# Altium schematic sheet FAT42.SchDoc
size A3
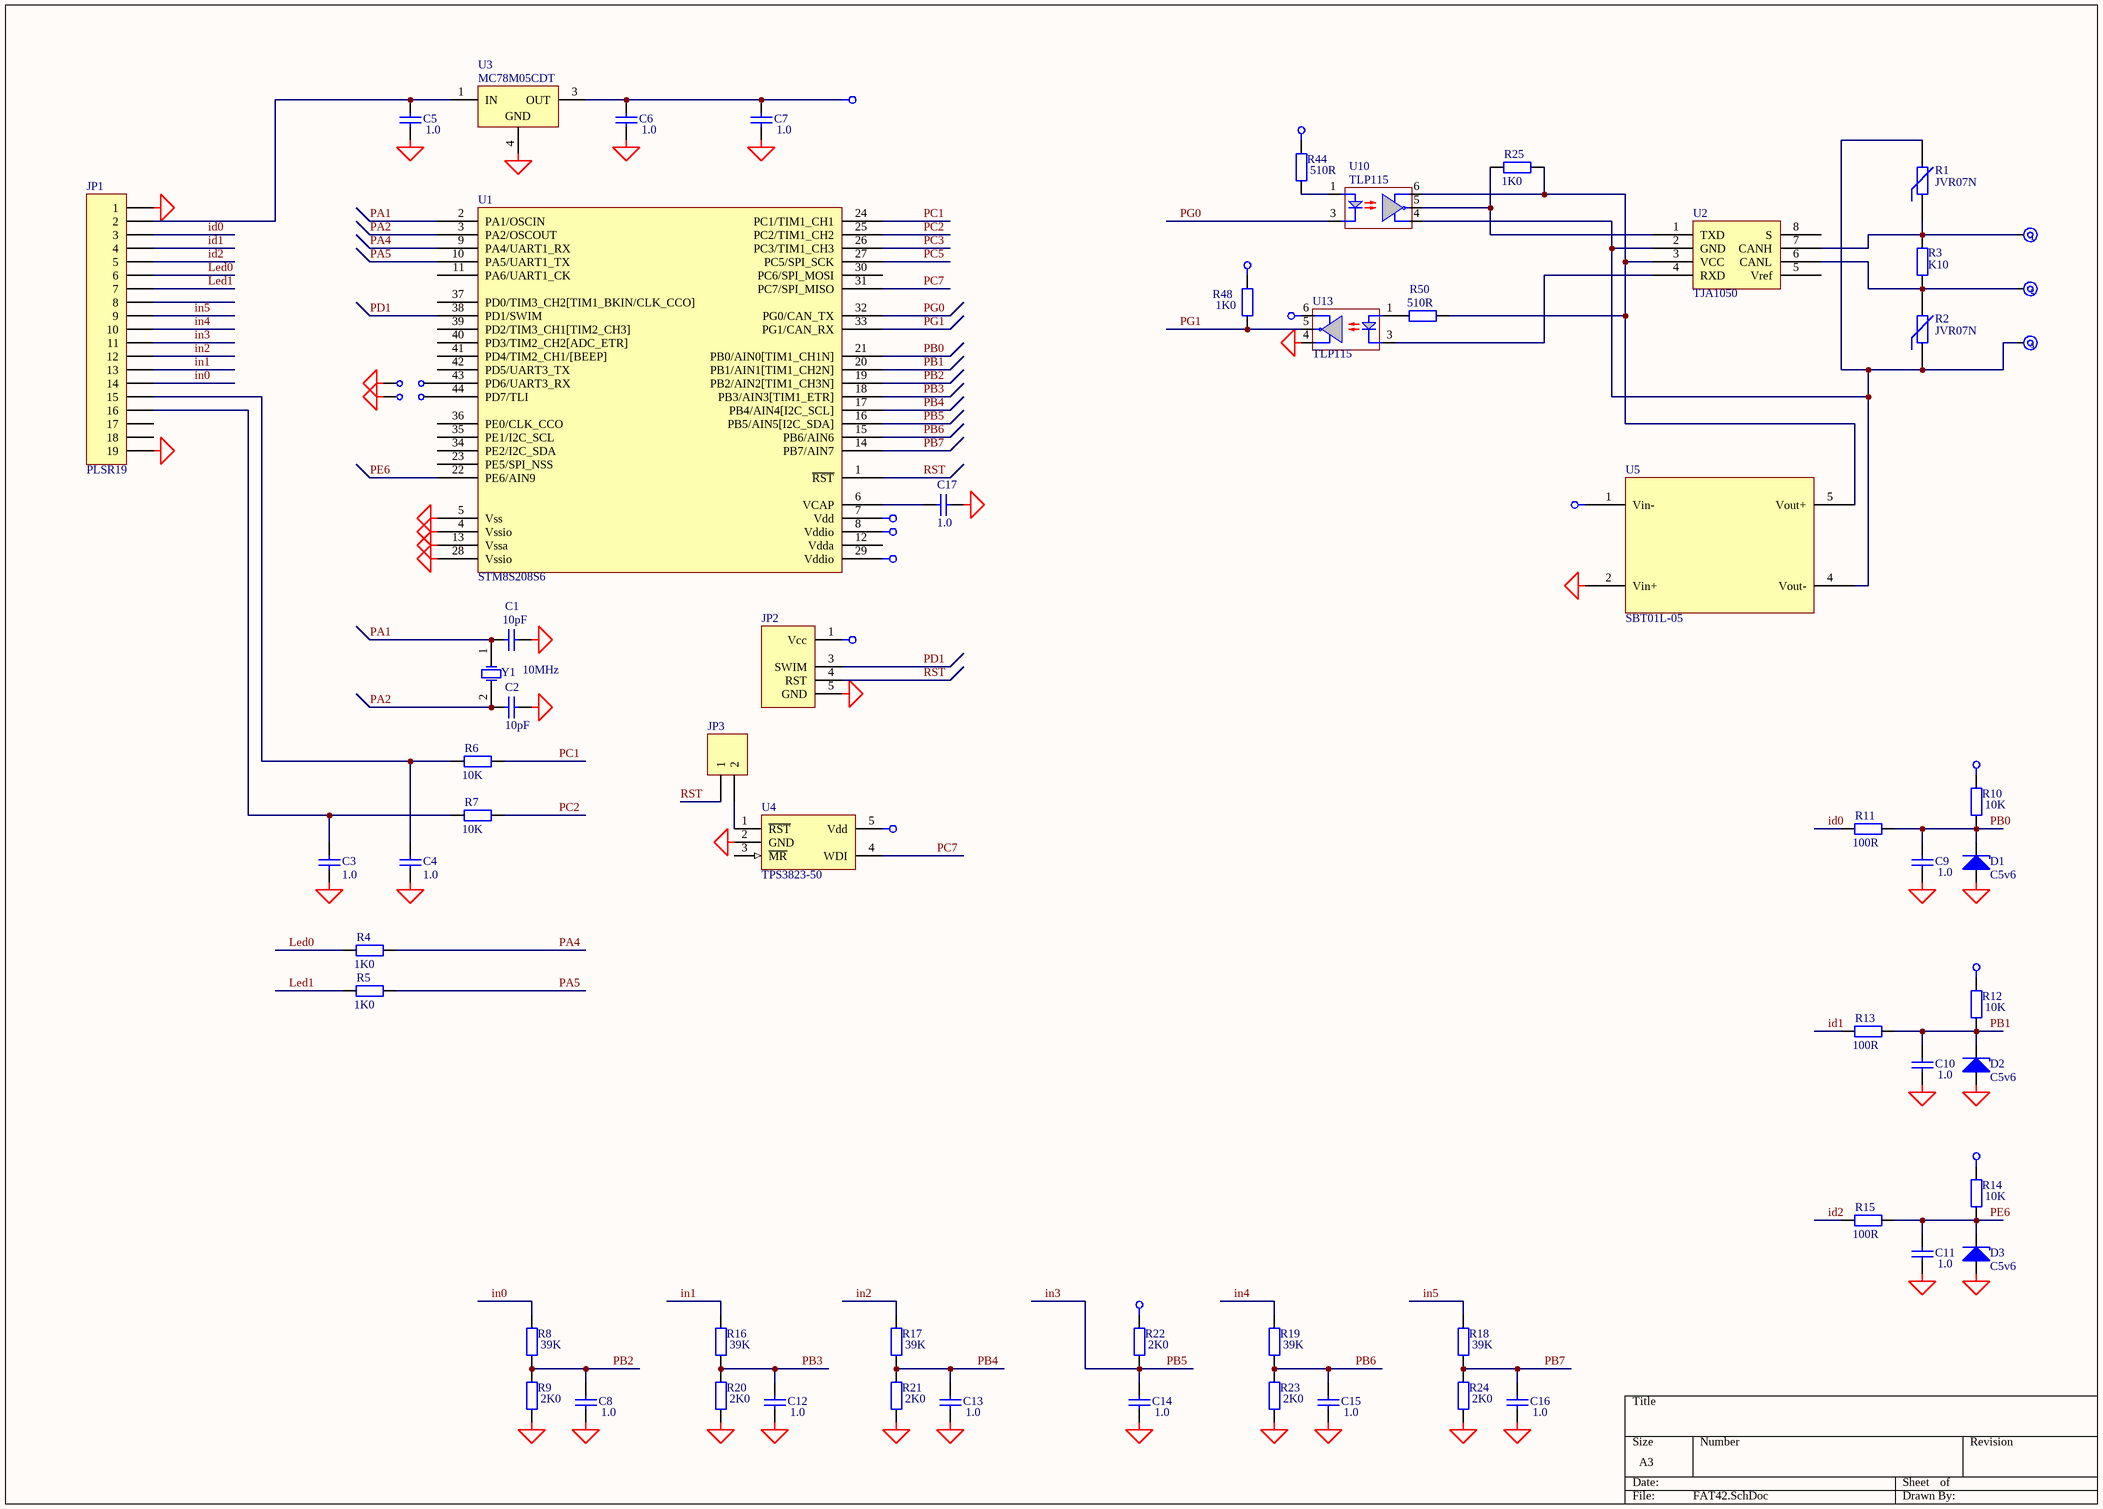
[diagram p0: FAT42.SchDoc]

## Parts
1  (no value)  [PIN2R]
2  (no value)  [PIN2R]
3  (no value)  [PIN2R]
C1  10pF  [_1206]
C2  10pF  [_1206]
C3  1.0  [_1206]
C4  1.0  [_1206]
C5  1.0  [_1206]
C6  1.0  [_1206]
C7  1.0  [_1206]
C8  1.0  [_1206]
C9  1.0  [_1206]
C10  1.0  [_1206]
C11  1.0  [_1206]
C12  1.0  [_1206]
C13  1.0  [_1206]
C14  1.0  [_1206]
C15  1.0  [_1206]
C16  1.0  [_1206]
C17  1.0  [_1206]
D1  C5v6  [_1206d]
D2  C5v6  [_1206d]
D3  C5v6  [_1206d]
J1  (no value)  [jmp]
J2  (no value)  [jmp]
JP1  PLSR19  [HDR1X19]
JP2  (no value)  [HDR1X5_uart]
JP3  PLS2  [HDR1X2]  (value not drawn)
R1  JVR07N  [JVR07N]
R2  JVR07N  [JVR07N]
R3  K10  [_1206]
R4  1K0  [_1206]
R5  1K0  [_1206]
R6  10K  [_1206]
R7  10K  [_1206]
R8  39K  [_1206]
R9  2K0  [_1206]
R10  10K  [_1206]
R11  100R  [_1206]
R12  10K  [_1206]
R13  100R  [_1206]
R14  10K  [_1206]
R15  100R  [_1206]
R16  39K  [_1206]
R17  39K  [_1206]
R18  39K  [_1206]
R19  39K  [_1206]
R20  2K0  [_1206]
R21  2K0  [_1206]
R22  2K0  [_1206]
R23  2K0  [_1206]
R24  2K0  [_1206]
R25  1K0  [_1206]
R44  510R  [_1206]
R48  1K0  [_1206]
R50  510R  [_1206]
U1  STM8S208S6  [QFP10X10-G44/G10N]
U2  TJA1050  [SO-G8/D5]
U3  MC78M05CDT  [SIP-G3/Z11.05]
U4  TPS3823-50  [SO-G5/P.95]
U5  SBT01L-05  [SBT01DET01]
U10  TLP115  [tlp115]
U13  TLP115  [tlp115]
Y1  10MHz  [QWARZ1]

## Nets
+5v: C6.2 C7.2 JP2.1(Vcc) R10.1 R12.1 R14.1 R22.2 R44.2 R48.2 U1.7(Vdd) U1.8(Vddio) U1.29(Vddio) U3.3(OUT) U4.5(Vdd) U5.1(Vin-) U13.6
GND: C1.1 C2.1 C3.1 C4.1 C5.1 C6.1 C7.1 C8.1 C9.1 C10.1 C11.1 C12.1 C13.1 C14.1 C15.1 C16.1 C17.1 D1.1(A) D2.1(A) D3.1(A) J1.1 J2.1 JP1.1 JP1.19 JP2.5(GND) R9.1 R20.1 R21.1 R23.1 R24.1 U1.4(Vssio) U1.5(Vss) U1.13(Vssa) U1.28(Vssio) U3.4(GND) U4.2(GND) U5.2(Vin+) U13.4
id0: JP1.3 R11.2
id1: JP1.4 R13.2
id2: JP1.5 R15.2
in0: JP1.14 R8.2
in1: JP1.13 R16.2
in2: JP1.12 R17.2
in3: C14.2 JP1.11 R22.1 U1.16(PB5/AIN5[I2C_SDA])  [also labelled PB5]
in4: JP1.10 R19.2
in5: JP1.9 R18.2
Led0: JP1.6 R4.1
Led1: JP1.7 R5.1
PA1: C1.2 U1.2(PA1/OSCIN) Y1.1(OSC1)
PA2: C2.2 U1.3(PA2/OSCOUT) Y1.2(OSC2)
PA4: R4.2 U1.9(PA4/UART1_RX)
PA5: R5.2 U1.10(PA5/UART1_TX)
PB0: C9.2 D1.2(K) R10.2 R11.1 U1.21(PB0/AIN0[TIM1_CH1N])
PB1: C10.2 D2.2(K) R12.2 R13.1 U1.20(PB1/AIN1[TIM1_CH2N])
PB2: C8.2 R8.1 R9.2 U1.19(PB2/AIN2[TIM1_CH3N])
PB3: C12.2 R16.1 R20.2 U1.18(PB3/AIN3[TIM1_ETR])
PB4: C13.2 R17.1 R21.2 U1.17(PB4/AIN4[I2C_SCL])
PB6: C15.2 R19.1 R23.2 U1.15(PB6/AIN6)
PB7: C16.2 R18.1 R24.2 U1.14(PB7/AIN7)
PC1: R6.1 U1.24(PC1/TIM1_CH1)
PC2: R7.1 U1.25(PC2/TIM1_CH2)
PC3: U1.26(PC3/TIM1_CH3)
PC5: U1.27(PC5/SPI_SCK)
PC7: U1.31(PC7/SPI_MISO) U4.4(WDI)
PD1: JP2.3(SWIM) U1.38(PD1/SWIM)
PE6: C11.2 D3.2(K) R14.2 R15.1 U1.22(PE6/AIN9)
PG0: U1.32(PG0/CAN_TX) U10.3
PG1: R48.1 U1.33(PG1/CAN_RX) U13.5
RST: JP2.4(RST) JP3.1 U1.1(~{RST})
Net1_1: 1.1 R1.1 R3.2 U2.7(CANH)
Net2_1: 2.1 R2.2 R3.1 U2.6(CANL)
Net3_1: 3.1 R1.2 R2.1 U2.2(GND) U5.4(Vout-) U10.4
NetC3_2: C3.2 JP1.16 R7.2
NetC4_2: C4.2 JP1.15 R6.2
NetC5_2: C5.2 JP1.2 U3.1(IN)
NetC17_2: C17.2 U1.6(VCAP)
NetJ1_2: J1.2 U1.43(PD6/UART3_RX)
NetJ2_2: J2.2 U1.44(PD7/TLI)
NetJP3_2: JP3.2 U4.1(~{RST})
NetR25_1: R25.1 U2.1(TXD) U10.5
NetR25_2: R25.2 R50.1 U2.3(VCC) U5.5(Vout+) U10.6
NetR44_1: R44.1 U10.1
NetR50_2: R50.2 U13.1
NetU2_4: U2.4(RXD) U13.3

Not connected (* = marked no-connect by the designer): JP1 8 17 18; U1 11(PA6/UART1_CK) 12(Vdda) 23(PE5/SPI_NSS) 30(PC6/SPI_MOSI) 34(PE2/I2C_SDA) 35(PE1/I2C_SCL) 36(PE0/CLK_CCO) 37(PD0/TIM3_CH2[TIM1_BKIN/CLK_CCO]) 39(PD2/TIM3_CH1[TIM2_CH3]) 40(PD3/TIM2_CH2[ADC_ETR]) 41(PD4/TIM2_CH1/[BEEP]) 42(PD5/UART3_TX); U2 5(Vref) 8(S); U4 3(~{MR})

## Library data of the parts
1-3 = Socket_Ring: Socket; Manufacturer: Generic Components; Class I: Connector; Revision: July-2002: Re-released for DXP Platform.; Publisher: Altium Limited
C1 C2 = Cap Semi: Capacitor (Semiconductor SIM Model); Manufacturer: Generic Components; Class I: Passive; Value: 15pF; Published: 8-Jun-2000; Revision: July-2002: Re-released for DXP Platform.; Publisher: Altium Limited; Class II: Capacitor
C3 C4 = Cap Semi: Capacitor (Semiconductor SIM Model); Manufacturer: Generic Components; Class I: Passive; Value: xxx; Published: 8-Jun-2000; Revision: July-2002: Re-released for DXP Platform.; Publisher: Altium Limited; Class II: Capacitor
C5-C17 = Cap Semi: Capacitor (Semiconductor SIM Model); Manufacturer: Generic Components; Class I: Passive; Value: 1,0; Published: 8-Jun-2000; Revision: July-2002: Re-released for DXP Platform.; Publisher: Altium Limited; Class II: Capacitor
D1-D3 = Zener: Default Diode; Manufacturer: Generic Components; Class I: Discrete; Class II: Diode - Switching; Value: BZV55C5V6; Published: 8-Jun-2000; Revision: July-2002: Re-released for DXP Platform.; Publisher: Altium Limited
J1 J2 = JMP: Switch; Manufacturer: Generic Components; Published: 24-Mar-1999; Revision: July-2002: Re-released for DXP Platform.; Publisher: Altium Limited
JP1 = Header 19: Header, 19-Pin; Manufacturer: Generic Components; Class I: Connector; Revision: July-2002: Re-released for DXP Platform.; Publisher: Altium Limited
JP2 = SWIM_CONN
JP3 = Header 2: Header, 2-Pin; Manufacturer: Generic Components; Class I: Connector; Revision: July-2002: Re-released for DXP Platform.; Publisher: Altium Limited
R1 R2 = Res Varistor: Varistor (Voltage-Sensitive Resistor); Manufacturer: Generic Components; Class I: Discrete; Published: 24-Mar-1999; Revision: July-2002: Re-released for DXP Platform.; Publisher: Altium Limited; Class II: Voltage-Sensitive Resistor
R3 = Res2: Resistor; Manufacturer: Generic Components; Class I: Passive; Value: 120; Published: 8-Jun-2000; Revision: July-2002: Re-released for DXP Platform.; Publisher: Altium Limited; Class II: Resistor
R4 R5 R9 R20-R24 = Res2: Resistor; Manufacturer: Generic Components; Class I: Passive; Value: 1K; Rule: Undefined; Published: 8-Jun-2000; Revision: July-2002: Re-released for DXP Platform.; Publisher: Altium Limited; Class II: Resistor
R6 R7 R10-R15 = Res2: Resistor; Manufacturer: Generic Components; Class I: Passive; Rule: Undefined; Published: 8-Jun-2000; Revision: July-2002: Re-released for DXP Platform.; Publisher: Altium Limited; Class II: Resistor
  R6 R7 R10 R12 R14: Value: 10K
  R11 R13 R15: Value: 100R
R8 R16-R19 = Res2: Resistor; Manufacturer: Generic Components; Class I: Passive; Value: 15K; Rule: Undefined; Published: 8-Jun-2000; Revision: July-2002: Re-released for DXP Platform.; Publisher: Altium Limited; Class II: Resistor
R25 R44 R50 = Res2: Resistor; Manufacturer: Generic Components; Class I: Passive; Published: 8-Jun-2000; Revision: July-2002: Re-released for DXP Platform.; Publisher: Altium Limited; Class II: Resistor
  R25: Value: 1K0
  R44 R50: Value: 510R
R48 = Res2: Resistor; Manufacturer: Generic Components; Class I: Passive; Value: 1K; Published: 8-Jun-2000; Revision: July-2002: Re-released for DXP Platform.; Publisher: Altium Limited; Class II: Resistor
U3 = MC78M05CDT: Three-Terminal Medium Current Positive Voltage Regulator; Manufacturer: ON Semiconductor; Package Information: Latest Revision: 1997; Class I: Power Management; Note: Pin 2 is electrically connected to Pin 4; Pin 2 is trimmed and not drawn;; Published: 15-Apr-2002; Datasheet: Latest Revision: Apr-2000; Package Reference: 369A-13; Publisher: Altium Limited; Class II: Voltage Regulator; Value: MC78M05CDT
U4 = TPS3823: Reset IC; Manufacturer: National Semiconductor; Package Information: Latest Revision: Aug-1999; Class I: Power Management; Class II: Voltage Regulator; Value: TPS76333; Published: 15-Apr-2002; Datasheet: Latest Revision: Oct-1999; Package Reference: MA05B; Publisher: Altium Limited
U5 = SBT01L
Y1 = XTAL: Crystal Oscillator; Manufacturer: Generic Components; Published: 8-Jun-2000; Revision: July-2002: Re-released for DXP Platform.; Publisher: Altium Limited; Class I: Oscillator; Class II: Crystal Oscillator; Value: 10MHz